# Altium schematic sheet VGA.SchDoc
size B; DocumentNumber: 5; SheetNumber: 5; SheetTotal: 8
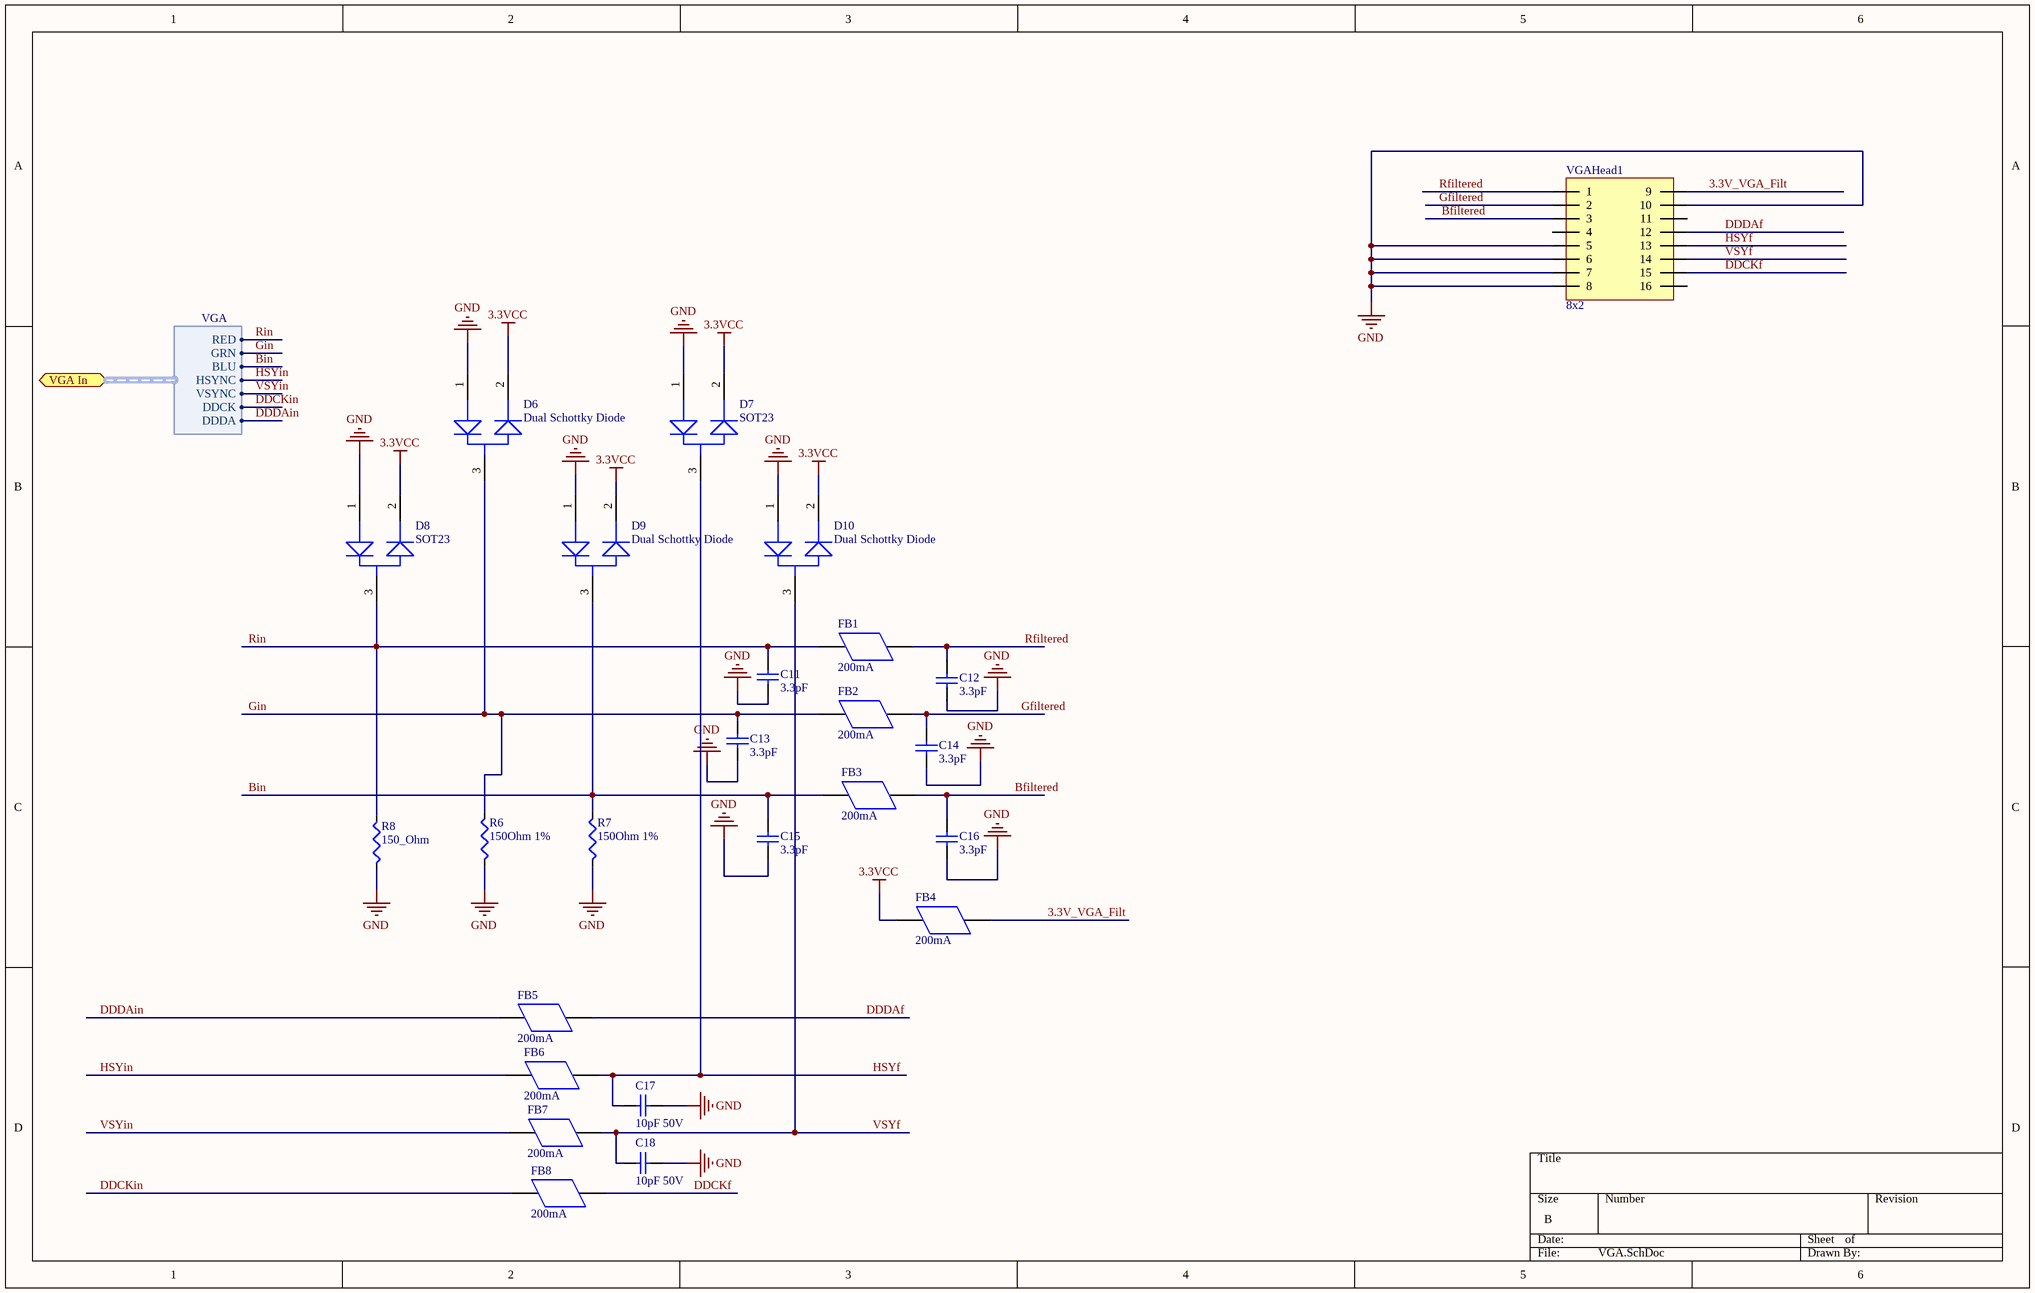
[diagram p0: VGA.SchDoc]

## Parts
C11  3.3pF  [0805 (2012) Capacitor]
C12  3.3pF  [0805 (2012) Capacitor]
C13  3.3pF  [0805 (2012) Capacitor]
C14  3.3pF  [0805 (2012) Capacitor]
C15  3.3pF  [0805 (2012) Capacitor]
C16  3.3pF  [0805 (2012) Capacitor]
C17  10pF 50V  [0805 (2012) Capacitor]
C18  10pF 50V  [0805 (2012) Capacitor]
D6  Dual Schottky Diode  [SOT23]
D7  SOT23  [SOT23]
D8  SOT23  [SOT23]
D9  Dual Schottky Diode  [SOT23]
D10  Dual Schottky Diode  [SOT23]
FB1  200mA  [0805 (2012) Capacitor]
FB2  200mA  [0805 (2012) Capacitor]
FB3  200mA  [0805 (2012) Capacitor]
FB4  200mA  [0805 (2012) Capacitor]
FB5  200mA  [0805 (2012) Capacitor]
FB6  200mA  [0805 (2012) Capacitor]
FB7  200mA  [0805 (2012) Capacitor]
FB8  200mA  [0805 (2012) Capacitor]
R6  150Ohm 1%  [R 0805 (2012) RESISTOR]
R7  150Ohm 1%  [R 0805 (2012) RESISTOR]
R8  150_Ohm  [R 0805 (2012) RESISTOR]
VGAHead1  8x2  [Male 8x2]

## Ports
VGA In (harness VGA)

## Harnesses
VGA: RED, GRN, BLU, HSYNC, VSYNC, DDCK, DDDA

## Nets
3.3VCC: D6.2 D7.2 D8.2 D9.2 D10.2 FB4.1
GND: C11.2 C12.2 C13.2 C14.2 C15.2 C16.2 C17.1 C18.1 D6.1 D7.1 D8.1 D9.1 D10.1 R6.1 R7.1 R8.1 VGAHead1.5 VGAHead1.6 VGAHead1.7 VGAHead1.8 VGAHead1.10
3.3V_VGA_Filt: FB4.2 VGAHead1.9
Bfiltered: C16.1 FB3.2 VGAHead1.3
Bin: C15.1 D9.3 FB3.1 R7.2 ; port VGA In.BLU
DDCKf: FB8.2 VGAHead1.15
DDCKin: FB8.1 ; port VGA In.DDCK
DDDAf: FB5.2 VGAHead1.12
DDDAin: FB5.1 ; port VGA In.DDDA
Gfiltered: C14.1 FB2.2 VGAHead1.2
Gin: C13.1 D6.3 FB2.1 R6.2 ; port VGA In.GRN
HSYf: C17.2 D7.3 FB6.2 VGAHead1.13
HSYin: FB6.1 ; port VGA In.HSYNC
Rfiltered: C12.1 FB1.2 VGAHead1.1
Rin: C11.1 D8.3 FB1.1 R8.2 ; port VGA In.RED
VSYf: C18.2 D10.3 FB7.2 VGAHead1.14
VSYin: FB7.1 ; port VGA In.VSYNC

Not connected (* = marked no-connect by the designer): VGAHead1 4 11 16

## Library data of the parts
C11-C18 = Capacitor (non-polarized): Capacitor; Supplier: Digi-Key
  C11-C16: Value: 3.3pF; Supplier Part Number: 478-1298-1-ND
  C17 C18: Value: 10pF; Supplier Part Number: 478-1304-1-ND
D7 D8 = Dual Schottky Diode: Supplier Part Number: 497-2516-1-ND; Supplier: Digi-Key
FB1-FB8 = Ferrite Beads: Supplier Part Number: 490-1041-1-ND; Supplier: Digi-Key
R6 R7 = Resistor: Value: 150Ohm 1%; Supplier Part Number: RHM150CRCT-ND; Supplier: Digi-Key
R8 = Resistor: Value: 150Ohm 1%; Supplier Part Number: RHM150CRCT-ND; Supplier: Digi-Key
VGAHead1 = 8x2: 8x2 100mil Header; Supplier Part Number: 609-3364-ND; Supplier: Digi-Key
D6 D9 D10 = Dual Schottky Diode: Supplier Part Number: 497-2516-1-ND; Supplier: Digi-Key